# EAGLE design ledsor (EAGLE 9.0.0)
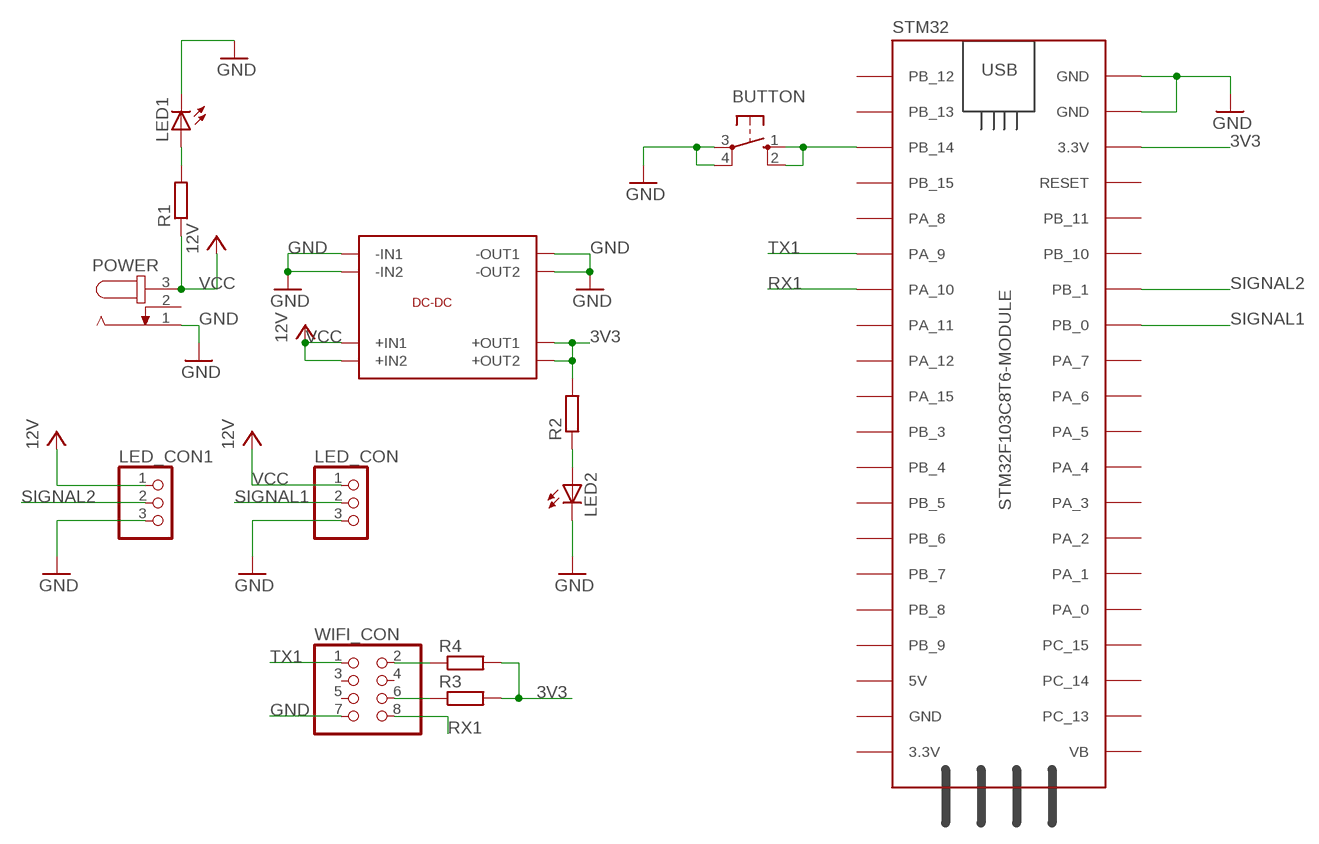
[diagram p0: schematic, sheet 1]

## Parts
BUTTON  10-XX  [B3F-10XX]
DC-DC  SDVR_SMALL  [SDVR_SMALL]
LED1  LED5MM  [LED5MM]
LED2  LED5MM  [LED5MM]
LED_CON  PINHD-1X3  [1X03]
LED_CON1  PINHD-1X3  [1X03]
POWER  JACK-PLUG1  [SPC4078]
R1  R-EU_0204/7  [0204/7]
R2  R-EU_0204/7  [0204/7]
R3  R-EU_0204/7  [0204/7]
R4  R-EU_0204/7  [0204/7]
STM32  STM32F103C8T6-MODULE  [STM32F103C8T6-MODULE]
WIFI_CON  PINHD-2X4  [2X04]

## Nets
3V3: DC-DC.P$7(+OUT1) DC-DC.P$8(+OUT2) R2.2 R3.2 R4.2 STM32.3.3V_2(3.3V)
GND: BUTTON.3(P) BUTTON.4(P1) DC-DC.P$1(-IN1) DC-DC.P$2(-IN2) DC-DC.P$5(-OUT1) DC-DC.P$6(-OUT2) LED1.K(C) LED2.K(C) LED_CON1.3 LED_CON.3 POWER.1 STM32.GND_2(GND) STM32.GND_3(GND) WIFI_CON.7
N$1: LED1.A R1.2
N$2: R3.1 WIFI_CON.6
N$3: LED2.A R2.1
N$4: R4.1 WIFI_CON.2
N$9: BUTTON.1(S) BUTTON.2(S1) STM32.PB_14
RX1: STM32.PA_10 WIFI_CON.8
SIGNAL1: LED_CON.2 STM32.PB_0
SIGNAL2: LED_CON1.2 STM32.PB_1
TX1: STM32.PA_9 WIFI_CON.1
VCC: DC-DC.P$3(+IN1) DC-DC.P$4(+IN2) LED_CON1.1 LED_CON.1 POWER.3 R1.1 ; supply symbol labelled 12V
Unconnected: POWER.2 STM32.3.3V_1(3.3V) STM32.5V STM32.GND_1(GND) STM32.PA_0 STM32.PA_1 STM32.PA_2 STM32.PA_3 STM32.PA_4 STM32.PA_5 STM32.PA_6 STM32.PA_7 STM32.PA_8 STM32.PA_11 STM32.PA_12 STM32.PA_15 STM32.PB_3 STM32.PB_4 STM32.PB_5 STM32.PB_6 STM32.PB_7 STM32.PB_8 STM32.PB_9 STM32.PB_10 STM32.PB_11 STM32.PB_12 STM32.PB_13 STM32.PB_15 STM32.PC_13 STM32.PC_14 STM32.PC_15 STM32.RESET STM32.VB WIFI_CON.3 WIFI_CON.4 WIFI_CON.5

## Library data of the parts
BUTTON = switch-omron:10-XX: OMRON SWITCH; MPN: B3F-1000; OC_FARNELL: 176432; OC_NEWARK: 36M3542
DC-DC = mylibrary:SDVR_SMALL: SDVR_SMALL Input voltage:4.5V-28V Output voltage:1.3V-17V Output current:Rated current is 2A,maximum 3A(Additional heatsink is required)
LED1 LED2 = led:LED: LED OSRAM: - CHIPLED LG R971, LG N971, LY N971, LG Q971, LY Q971, LO R971, LY R971 LH N974, LH R974 LS Q976, LO Q976, LY Q976 LO Q996 - Hyper CHIPLED LW Q18S LB Q993, LB Q99A, LB R99A - SideLED LS A670, LO A670, LY A670, LG A670, LP A670 LB A673, LV A673, LT A673, LW A673 LH A674 LY A675 LS A676, LA A676, LO A676, LY A676, LW A676 LS A679, LY A679, LG A679 - Hyper Micro SIDELED® LS Y876, LA Y876, LO Y876, LY Y876 LT Y87S - SmartLED LW L88C, LW L88S LB L89C, LB L89S, LG L890 LS L89K, LO L89K, LY L89K LS L896, LA L896, LO L896, LY L896 - TOPLED LS T670, LO T670, LY T670, LG T670, LP T670 LSG T670, LSP T670, LSY T670, LOP T670, LYG T670 LG T671, LOG T671, LSG T671 LB T673, LV T673, LT T673, LW T673 LH T674 LS T676, LA T676, LO T676, LY T676, LB T676, LH T676, LSB T676, LW T676 LB T67C, LV T67C, LT T67C, LS T67K, LO T67K, LY T67K, LW E67C LS E67B, LA E67B, LO E67B, LY E67B, LB E67C, LV E67C, LT E67C LW T67C LS T679, LY T679, LG T679 LS T770, LO T770, LY T770, LG T770, LP T770 LB T773, LV T773, LT T773, LW T773 LH T774 LS E675, LA E675, LY E675, LS T675 LS T776, LA T776, LO T776, LY T776, LB T776 LHGB T686 LT T68C, LB T68C - Hyper Mini TOPLED® LB M676 - Mini TOPLED Santana® LG M470 LS M47K, LO M47K, LY M47K Source: http://www.osram.convergy.de LUXEON: - LUMILED® LXK2-PW12-R00, LXK2-PW12-S00, LXK2-PW14-U00, LXK2-PW14-V00 LXK2-PM12-R00, LXK2-PM12-S00, LXK2-PM14-U00 LXK2-PE12-Q00, LXK2-PE12-R00, LXK2-PE12-S00, LXK2-PE14-T00, LXK2-PE14-U00 LXK2-PB12-K00, LXK2-PB12-L00, LXK2-PB12-M00, LXK2-PB14-N00, LXK2-PB14-P00, LXK2-PB14-Q00 LXK2-PR12-L00, LXK2-PR12-M00, LXK2-PR14-Q00, LXK2-PR14-R00 LXK2-PD12-Q00, LXK2-PD12-R00, LXK2-PD12-S00 LXK2-PH12-R00, LXK2-PH12-S00 LXK2-PL12-P00, LXK2-PL12-Q00, LXK2-PL12-R00 Source: www.luxeon.com KINGBRIGHT: KA-3528ASYC Source: www.kingbright.com
LED_CON LED_CON1 = pinhead:PINHD-1X3: PIN HEADER
POWER = con-jack:JACK-PLUG: DC POWER JACK Power Jack, DC, Right Angle, Through Hole, Rated 5A at 16VDC, PC Terminals Distributor: Farnell (www.Farnell.de) Drawing: 84N1161.pdf / 84N1162.pdf Manufacturer: SPC Technology (www.spctechnology.com) Type: SPC4077 / SPC 4078; OC_FARNELL: unknown; OC_NEWARK: unknown
R1-R4 = rcl:R-EU_: RESISTOR, European symbol; SPICEPREFIX: R
STM32 = stm32f103c8t6_module:STM32F103C8T6-MODULE: STM32F103C8T6 module with ARM Cortex-3, 20kB SRAM, 64kB Flash, 72MHz
WIFI_CON = pinhead:PINHD-2X4: PIN HEADER

## Net classes
0 default: width 0.508 mm, clearance 0.254 mm

## Board
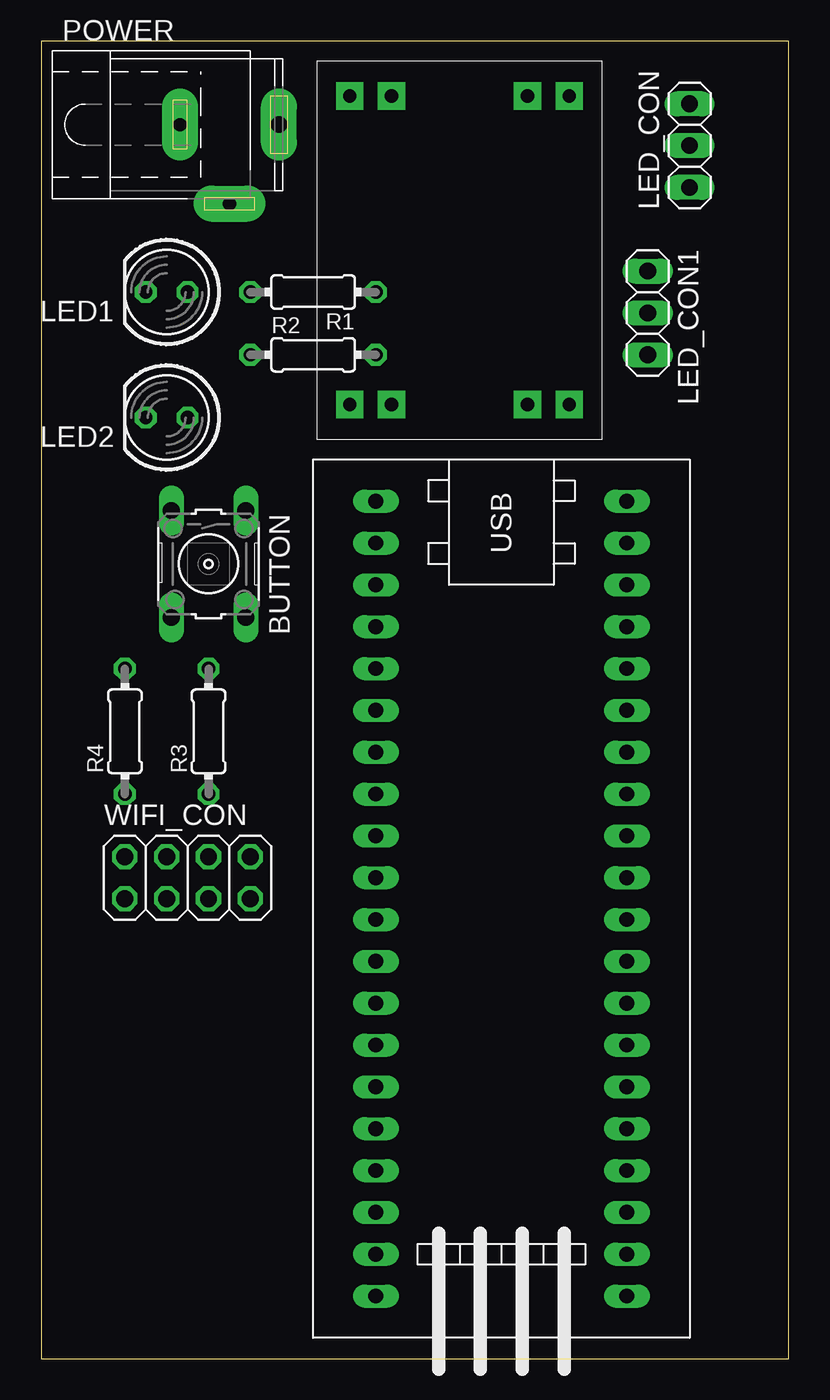
[diagram p1: board, top side]
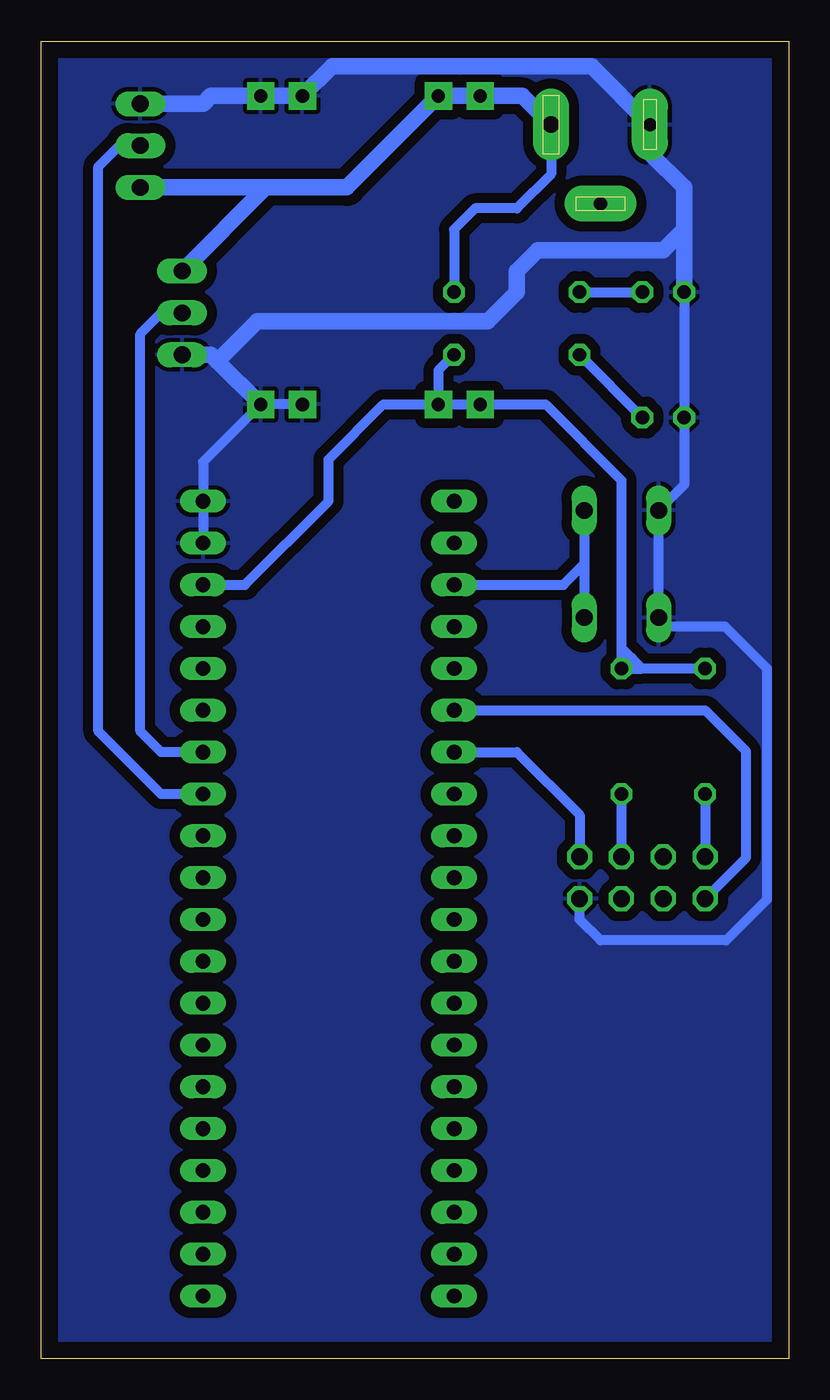
[diagram p2: board, bottom side, seen from below]

Size 45.39 x 80 mm. Coordinates in mm from the lower left corner, seen from the top.
Outline: 0,0 45.39,0 45.39,80 0,80 0,0
Copper layers (1*16): Top 0.035mm / dielectric 1.5mm / Bottom 0.035mm
Design rules "default *": minimum track width 6mil, minimum drill 0.35mm, track to track 24mil, track to pad 24mil, pad to pad 24mil, via to via 24mil, smd to smd 24mil, copper to edge 40mil, drill to drill 6mil, minimum pad ring 10mil, minimum via ring 8mil, stop-mask expansion 4mil, vias tented up to drill 0mil, thermal gap 10mil

### Footprints (pad centres in the part's own frame; a part is rotated, then mirrored left to right if it is on the bottom)
B3F-10XX = drill 1.016 long: 1 -3.251,2.261; 2 3.251,2.261; 3 -3.251,-2.261; 4 3.251,-2.261
SDVR_SMALL = drill 0.8 pad 1.651 square: P$1 -9.366,6.668; P$2 -9.366,4.128; P$3 -9.366,-4.128; P$4 -9.366,-6.668; P$5 9.366,6.668; P$6 9.366,4.128; P$7 9.366,-4.128; P$8 9.366,-6.668
LED5MM = drill 0.813 octagon: A -1.27,0; K 1.27,0
1X03 = drill 1.016 long: 1 -2.54,0; 2 0,0; 3 2.54,0
SPC4078 = drill 0.8 pad 2.184 long: 1 -3,0; 2 0,-4.8 | drill 1 pad 2.184 long: 3 3,0
0204/7 = drill 0.813 octagon: 1 -3.81,0; 2 3.81,0
STM32F103C8T6-MODULE = drill 0.9 long: 3.3V_1 25.4,-7.62; 3.3V_2 -17.78,7.62; 5V 20.32,-7.62; GND_1 22.86,-7.62; GND_2 -20.32,7.62; GND_3 -22.86,7.62; PA_0 15.24,7.62; PA_1 12.7,7.62; PA_2 10.16,7.62; PA_3 7.62,7.62; PA_4 5.08,7.62; PA_5 2.54,7.62; PA_6 0,7.62; PA_7 -2.54,7.62; PA_8 -12.7,-7.62; PA_9 -10.16,-7.62; PA_10 -7.62,-7.62; PA_11 -5.08,-7.62; PA_12 -2.54,-7.62; PA_15 0,-7.62; PB_0 -5.08,7.62; PB_1 -7.62,7.62; PB_3 2.54,-7.62; PB_4 5.08,-7.62; PB_5 7.62,-7.62; PB_6 10.16,-7.62; PB_7 12.7,-7.62; PB_8 15.24,-7.62; PB_9 17.78,-7.62; PB_10 -10.16,7.62; PB_11 -12.7,7.62; PB_12 -22.86,-7.62; PB_13 -20.32,-7.62; PB_14 -17.78,-7.62; PB_15 -15.24,-7.62; PC_13 22.86,7.62; PC_14 20.32,7.62; PC_15 17.78,7.62; RESET -15.24,7.62; VB 25.4,7.62
2X04 = drill 1.016 octagon: 1 -3.81,-1.27; 2 -3.81,1.27; 3 -1.27,-1.27; 4 -1.27,1.27; 5 1.27,-1.27; 6 1.27,1.27; 7 3.81,-1.27; 8 3.81,1.27

### Placement (x,y rotation side)
BUTTON  10.16,48.26 270 top
DC-DC  25.4,67.31 270 top
LED1  7.62,64.77 180 top
LED2  7.62,57.15 180 top
LED_CON  39.37,73.66 90 top
LED_CON1  36.83,63.5 270 top
POWER  11.43,74.93 0 top
R1  16.51,64.77 180 top
R2  16.51,60.96 0 top
R3  10.16,38.1 90 top
R4  5.08,38.1 90 top
STM32  27.94,29.21 270 top
WIFI_CON  8.89,29.21 0 top

### Tracks (layer width: path | path; a pad name or v marks a point on that pad's centre or on a via)
3V3
  Bottom 0.61: STM32.3.3V_2 33.02,46.99 27.94,52.07 27.94,54.61 24.61,57.94 DC-DC.P$7 | DC-DC.P$7 DC-DC.P$8 14.76,57.94 10.16,53.34 10.16,43.18 | 10.16,43.18 R3.2 | 8.89,41.91 9.53,42.55 | 9.53,42.55 10.16,43.18 | R4.2 8.89,41.91 | R3.2 8.89,41.91 | R3.2 9.53,42.55 | R2.2 21.27,60.01 DC-DC.P$7
GND
  Bottom 0.61: WIFI_CON.7 12.7,26.67 11.43,25.4 3.81,25.4 1.32,27.89 1.32,41.91 3.86,44.45 7.34,44.45 BUTTON.4 BUTTON.3 6.35,53.06 LED2.K LED1.K | STM32.GND_2 STM32.GND_3 35.56,54.45 DC-DC.P$5 DC-DC.P$6
  Bottom 1.016: LED_CON.3 35.56,76.2 35.08,76.68 DC-DC.P$1 DC-DC.P$2 27.73,78.48 11.98,78.48 POWER.1 8.43,73.2 6.35,71.12 6.35,68.58 | LED_CON1.3 35.08,60.96 34.69,60.56 | 34.69,60.56 DC-DC.P$5 | 6.35,68.58 LED1.K | 6.35,68.58 7.62,67.31 15.24,67.31 16.51,66.04 16.51,64.77 18.29,62.99 32.26,62.99 34.69,60.56
  pour Bottom: -2.54,82.55 -2.54,-2.54 46.99,-2.54 48.26,-1.27 48.26,80.01 45.72,82.55
N$1
  Bottom 0.61: R1.2 LED1.A
N$2
  Bottom 0.61: R3.1 WIFI_CON.6
N$3
  Bottom 0.61: R2.1 LED2.A
N$4
  Bottom 0.61: R4.1 WIFI_CON.2
N$9
  Bottom 0.61: BUTTON.1 12.42,48.26 | 12.42,48.26 BUTTON.2 | 12.42,48.26 13.69,46.99 STM32.PB_14
RX1
  Bottom 0.61: STM32.PA_10 16.51,36.83 12.7,33.02 WIFI_CON.8
SIGNAL1
  Bottom 0.61: STM32.PB_0 38.1,34.29 41.91,38.1 41.91,72.39 40.64,73.66 LED_CON.2
SIGNAL2
  Bottom 0.61: STM32.PB_1 38.1,36.83 39.37,38.1 39.37,62.23 38.1,63.5 LED_CON1.2
TX1
  Bottom 0.61: STM32.PA_9 5.08,39.37 2.59,36.88 2.59,30.43 WIFI_CON.1
VCC
  Bottom 0.61: POWER.3 14.43,71.93 16.51,69.85 19.05,69.85 20.32,68.58 R1.1
  Bottom 1.016: POWER.3 16.18,76.68 DC-DC.P$4 DC-DC.P$3 26.83,71.12 31.75,71.12 | 31.75,71.12 LED_CON.1 | LED_CON1.1 31.75,71.12